# Altium project pca20037.PrjPCB
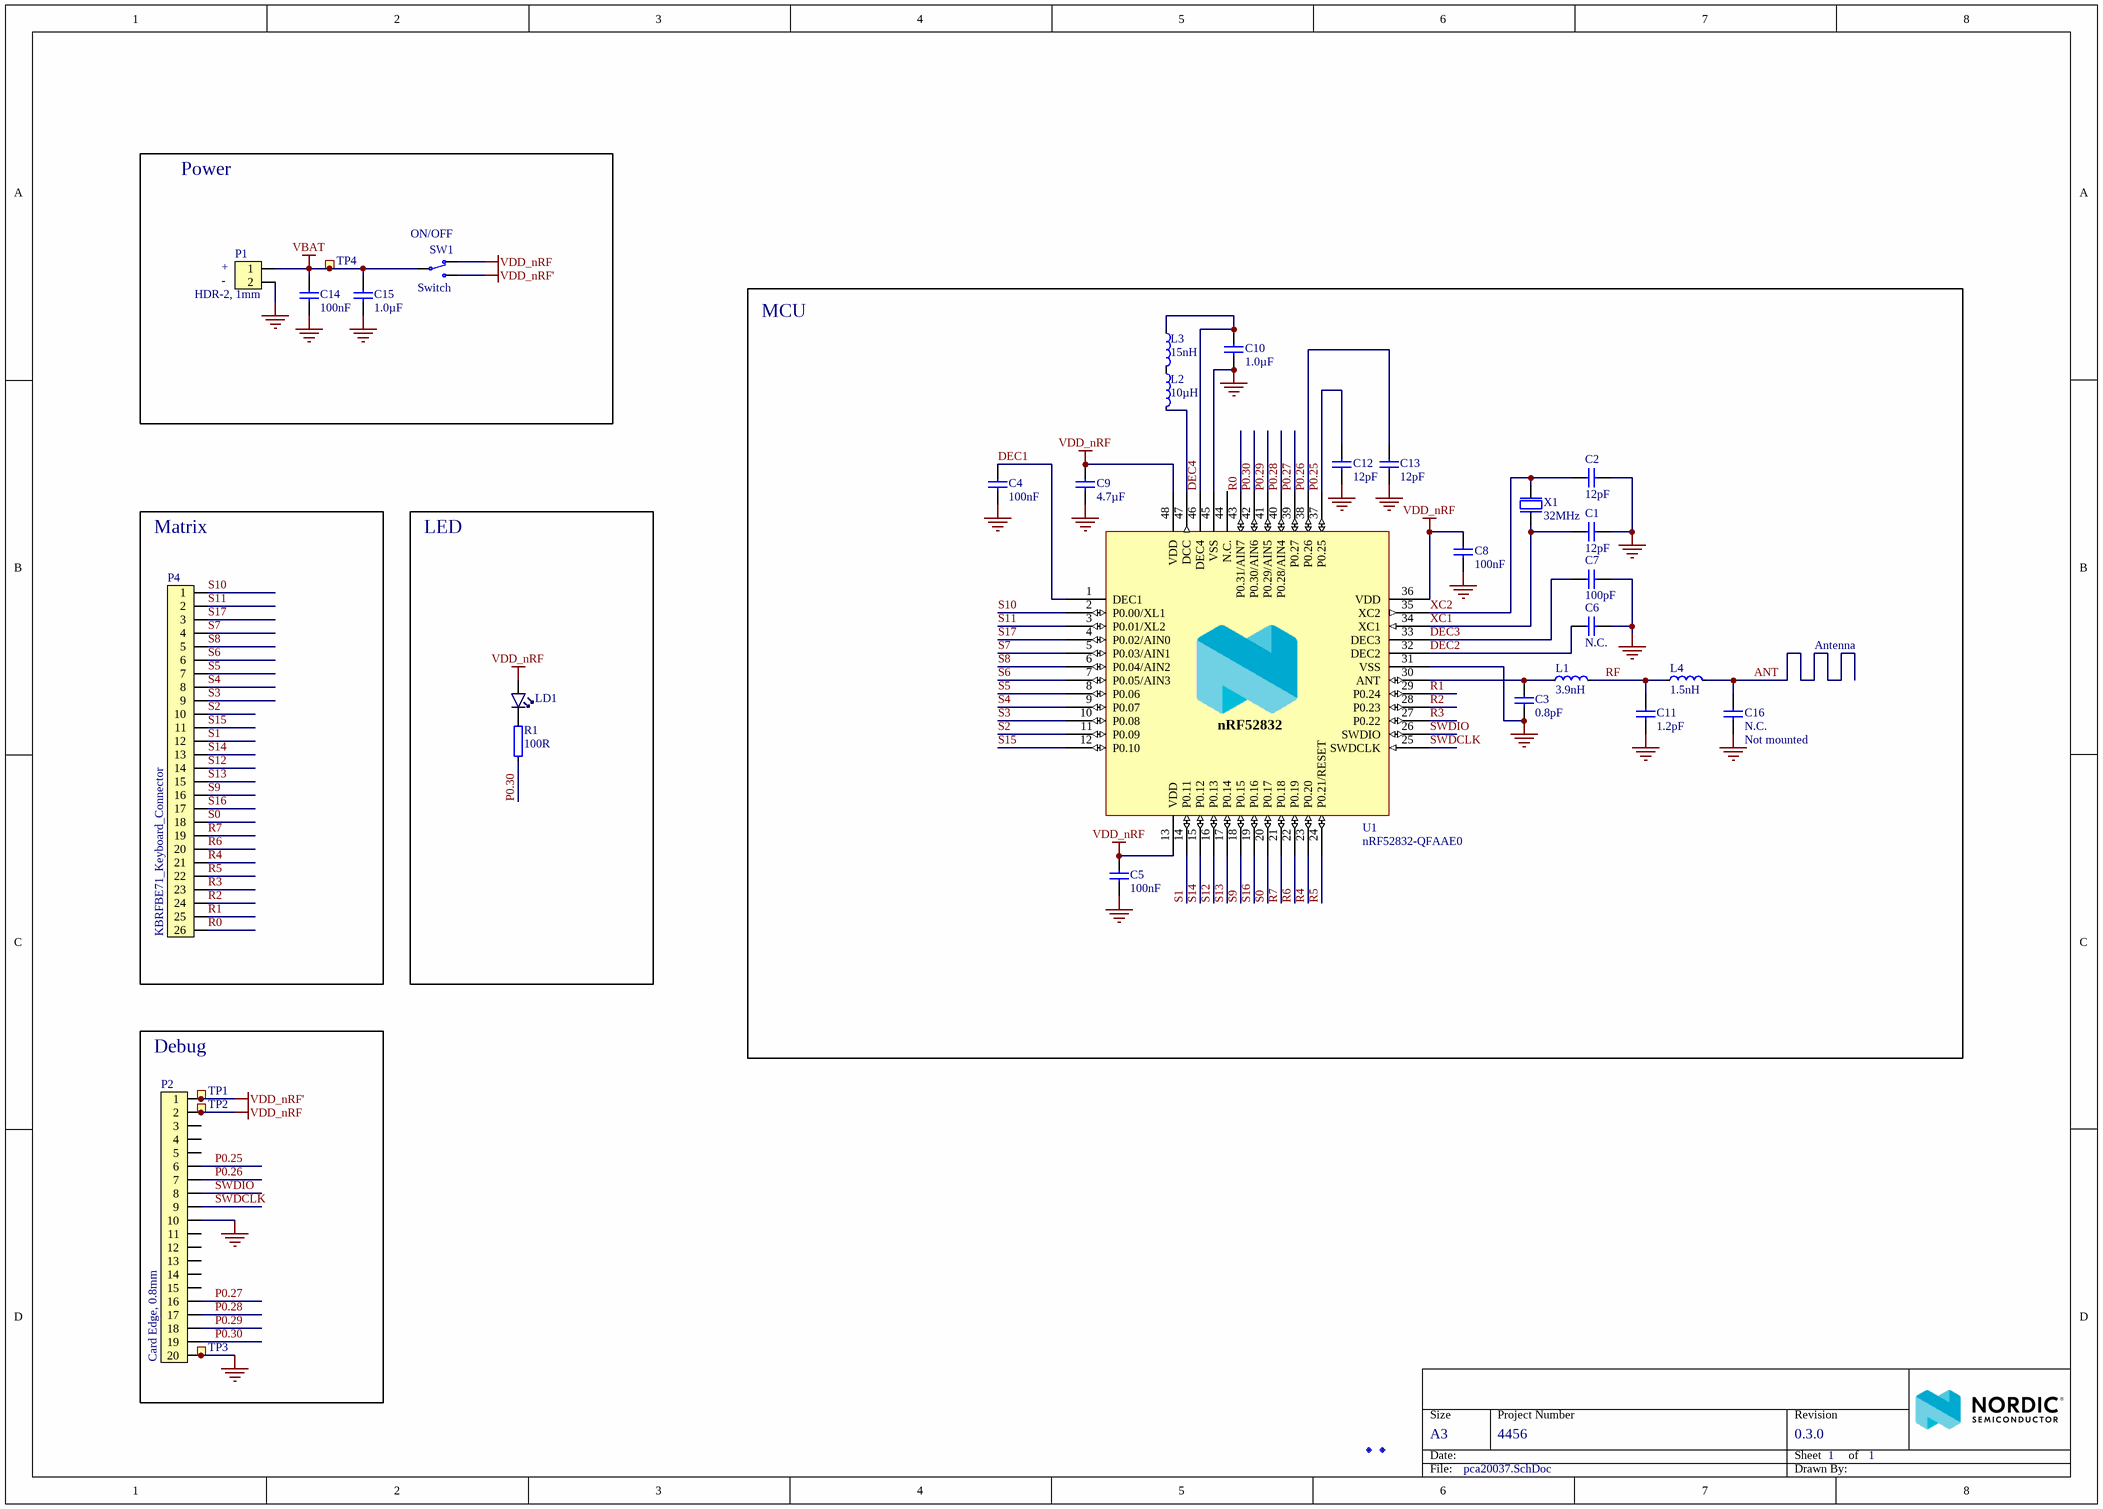
[diagram p0: pca20037.SchDoc]
Author: KJP/MASI; BoardThickness: 1.2mm; BoardTitle: nRF52832 Desktop Keyboard; NrOfLayers: 2; Organization: Nordic Semiconductor; PCAName: PCA20037; PCBNumber: 400342; PCBRevision: 0015MASI; PCBStackup: 2001; ProjectName: Demo Projects Applications Group; ProjectNumber: 4456; Revision: 0.3.0; SilkscreenColor: White; SoldermaskColor: Blue; SurfaceFinish: Lead-Free HASL
1 sheet, 34 parts. Net scope: global (net labels, ports and power ports of the same name join across sheets).
Board file: 400342.PcbDoc

## Sheet pca20037.SchDoc: =BoardTitle
size A3; Organization: Nordic Semiconductor; DocumentNumber: 1; Revision: 0.3.0; SheetNumber: 1; SheetTotal: 1; Author: KJP/MASI; CompanyName: Nordic Semiconductor; DrawnBy: KJP/MASI; ProjectNumber: 4456; ProjectName: Demo Projects Applications Group

### Parts
C1  12pF  [CAPC1005X04L]
C2  12pF  [CAPC1005X04L]
C3  0.8pF  [CAPC1005X04L]
C4  100nF  [CAPC1005X04L]
C5  100nF  [CAPC1005X04L]
C6  N.C.  [CAPC1005X04L]
C7  100pF  [CAPC1005X04L]
C8  100nF  [CAPC1005X04L]
C9  4.7µF  [CAPC1608X06L]
C10  1.0µF  [CAPC1608X06L]
C11  1.2pF  [CAPC1005X04L]
C12  12pF  [CAPC1005X04L]
C13  12pF  [CAPC1005X04L]
C14  100nF  [CAPC1005X04L]
C15  1.0µF  [CAPC1608X06L]
C16  N.C.  Assembly: Not mounted  [CAPC1005X04L]
Fiducual1  Fiducial mark  [Fiducial]  (value not drawn)
Fiducual2  Fiducial mark  [Fiducial]  (value not drawn)
L1  3.9nH  [INDC1005X04L]
L2  10µH  [INDC1608X06L]
L3  15nH  [INDC1005X04L]
L4  1.5nH  [INDC1005X04L]
LD1  L0603R  [LED_0603_R]  (value not drawn)
P1  HDR-2, 1mm  [SM02B-SRSS-TB]
P2  Card Edge, 0.8mm  [10056847-101LF]
P4  KBRFBE71_Keyboard_Connector  [KBRFBE71_Keyboard_Connector]
R1  100R  [RESC1005X04L]
SW1  Switch  [JS102011SAQN]
TP1  Ø0.7mm,SMD  [TP_SMD_Ø0.7mm]  (value not drawn)  (no BOM)
TP2  Ø0.7mm,SMD  [TP_SMD_Ø0.7mm]  (value not drawn)  (no BOM)
TP3  Ø0.7mm,SMD  [TP_SMD_Ø0.7mm]  (value not drawn)  (no BOM)
TP4  Ø0.7mm,SMD  [TP_SMD_Ø0.7mm]  (value not drawn)  (no BOM)
U1  nRF52832-QFAAE0  [QFN40P600X600X90-48N]
X1  32MHz  [BT-XTAL_2016]

### Blocks framed on the sheet
Power: C14 C15 P1 SW1 TP4
MCU: C1-C13 C16 L1-L4 U1 X1
Matrix: P4
LED: LD1 R1
Debug: P2 TP1-TP3

### Nets
GND: C1.2 C2.2 C3.1 C4.2 C5.2 C6.1 C7.2 C8.2 C9.2 C10.1 C11.2 C12.2 C13.2 C14.1 C15.1 C16.1 P1.2 P2.10 P2.20 TP3.1 U1.31(VSS) U1.45(VSS) U1.49(GND) X1.2(GND) X1.4(GND)
VBAT: C14.2 C15.2 P1.1 SW1.2(COM) TP4.1
VDD_nRF: C5.1 C8.1 C9.1 LD1.2(A) P2.2 SW1.1(N.C) TP2.1 U1.13(VDD) U1.36(VDD) U1.48(VDD)
VDD_nRF': P2.1 SW1.3(N.O) TP1.1
ANT: C16.2 L4.2
DEC1: C4.1 U1.1(DEC1)
DEC2: C6.2 U1.32(DEC2)
DEC3: C7.1 U1.33(DEC3)
DEC4: C10.2 L3.1 U1.46(DEC4)
P0.25: C12.1 P2.6 U1.37(P0.25)
P0.26: C13.1 P2.7 U1.38(P0.26)
P0.27: P2.16 U1.39(P0.27)
P0.28: P2.17 U1.40(P0.28/AIN4)
P0.29: P2.18 U1.41(P0.29/AIN5)
P0.30: P2.19 R1.1 U1.42(P0.30/AIN6)
R0: P4.26 U1.43(P0.31/AIN7)
R1: P4.25 U1.29(P0.24)
R2: P4.24 U1.28(P0.23)
R3: P4.23 U1.27(P0.22)
R4: P4.21 U1.23(P0.20)
R5: P4.22 U1.24(P0.21/RESET)
R6: P4.20 U1.22(P0.19)
R7: P4.19 U1.21(P0.18)
RF: C11.1 L1.2 L4.1
S0: P4.18 U1.20(P0.17)
S1: P4.12 U1.14(P0.11)
S2: P4.10 U1.11(P0.09)
S3: P4.9 U1.10(P0.08)
S4: P4.8 U1.9(P0.07)
S5: P4.7 U1.8(P0.06)
S6: P4.6 U1.7(P0.05/AIN3)
S7: P4.4 U1.5(P0.03/AIN1)
S8: P4.5 U1.6(P0.04/AIN2)
S9: P4.16 U1.18(P0.15)
S10: P4.1 U1.2(P0.00/XL1)
S11: P4.2 U1.3(P0.01/XL2)
S12: P4.14 U1.16(P0.13)
S13: P4.15 U1.17(P0.14)
S14: P4.13 U1.15(P0.12)
S15: P4.11 U1.12(P0.10)
S16: P4.17 U1.19(P0.16)
S17: P4.3 U1.4(P0.02/AIN0)
SWDCLK: P2.9 U1.25(SWDCLK)
SWDIO: P2.8 U1.26(SWDIO)
XC1: C1.1 U1.34(XC1) X1.1(inp)
XC2: C2.1 U1.35(XC2) X1.3(out)
NetC3_2: C3.2 L1.1 U1.30(ANT)
NetL2_1: L2.1 L3.2
NetL2_2: L2.2 U1.47(DCC)
NetLD1_1: LD1.1(C) R1.2

Not connected (* = marked no-connect by the designer): P2 3 4 5 11 12 13 14 15; U1 44(N.C.)

### Notes on the sheet
- (near SW1) ON/OFF
- (near P1) +
- (near P1) -
- Antenna
- Size
- Date:
- A3
- Project Number
- Sheet         of
- Revision
- File:
- Drawn By:
- (in symbol nRF52832-QFAAE0) nRF52832

### Library data of the parts
C1 C2 C12 C13 = C0402-12p: Capacitor, NP0, ±2%; Part number IPS: 00000002398; Note: 50V; Artikkelnr Noca: 20029159; Part Number: C0402-12p; Manufacturer: *; Manufacturer Part Number: *; LatestRevisionDate: 2011-05-11; Pin Count: 2; Publisher: Nordic Semiconductor; Published: 2009-05-08; Value: 12pF; Footprint Doc: 0402; ComponentLink1URL: *; ComponentLink1Description: Datasheet; ComponentLink2URL: *; ComponentLink2Description: Supplier link; HelpURL: *; Supplier 1: *; Supplier Part Number 1: *; Supplier 2: *; Supplier Part Number 2: *
C3 = C0402-0.8p: Capacitor, NP0, ±5%; Part number IPS: 00000007782; Note: 50V; Artikkelnr Noca: 20029147; Part Number: C0402-0.8p; Manufacturer: *; Manufacturer Part Number: *; LatestRevisionDate: 2012-11-21; Pin Count: 2; Publisher: Nordic Semiconductor; Published: 2009-05-08; Value: 0.8pF; Footprint Doc: 0402; ComponentLink1URL: *; ComponentLink1Description: Datasheet; ComponentLink2URL: *; ComponentLink2Description: Supplier link; HelpURL: *; Supplier 1: *; Supplier Part Number 1: *; Supplier 2: *; Supplier Part Number 2: *
C4 C5 C8 C14 = C0402-100n: Capacitor, X7R, ±10%; Part number IPS: 00000005296; Note: 16V; Artikkelnr Noca: 20039200; Part Number: C0402-100n; Manufacturer: *; Manufacturer Part Number: *; LatestRevisionDate: 2009-11-23; Pin Count: 2; Publisher: Nordic Semiconductor; Published: 2009-05-08; Value: 100nF; Footprint Doc: 0402; ComponentLink1URL: *; ComponentLink1Description: Datasheet; ComponentLink2URL: *; ComponentLink2Description: Supplier link; HelpURL: *; Supplier 1: *; Supplier Part Number 1: *; Supplier 2: *; Supplier Part Number 2: *
C6 = C0402-N.C.: Not mounted; Note: Chip Cap; Artikkelnr Noca: N.A.; Assembly: Not mounted; Part Number: C0402-N.C.; Manufacturer: *; Manufacturer Part Number: *; LatestRevisionDate: 2009-05-08; Pin Count: 2; Publisher: Nordic Semiconductor; Published: 2009-05-08; Value: N.C.; Footprint Doc: 0402; Part number IPS: N.A.; ComponentLink1URL: *; ComponentLink1Description: Datasheet; ComponentLink2URL: *; ComponentLink2Description: Supplier link; HelpURL: *; Supplier 1: *; Supplier Part Number 1: *; Supplier 2: *; Supplier Part Number 2: *
C7 = C0402-100p: Capacitor, NP0, ±5%; Part number IPS: 00000002361; Note: 50V; Artikkelnr Noca: 20029135; Part Number: C0402-100p; Manufacturer: *; Manufacturer Part Number: *; LatestRevisionDate: 2009-05-08; Pin Count: 2; Publisher: Nordic Semiconductor; Published: 2009-05-08; Value: 100pF; Footprint Doc: 0402; ComponentLink1URL: *; ComponentLink1Description: Datasheet; ComponentLink2URL: *; ComponentLink2Description: Supplier link; HelpURL: *; Supplier 1: *; Supplier Part Number 1: *; Supplier 2: *; Supplier Part Number 2: *
C9 = C0603-4µ7: Capacitor, X5R, ±10%; Part number IPS: 00000007783; Note: 6.3V; Artikkelnr Noca: 20069060; Part Number: C0603-4µ7; Manufacturer: *; Manufacturer Part Number: *; LatestRevisionDate: 2009-11-23; Pin Count: 2; Publisher: Nordic Semiconductor; Published: 2009-05-08; Value: 4.7µF; Footprint Doc: 0603; ComponentLink1URL: *; ComponentLink1Description: Datasheet; ComponentLink2URL: *; ComponentLink2Description: Supplier link; HelpURL: *; Supplier 1: *; Supplier Part Number 1: *; Supplier 2: *; Supplier Part Number 2: *
C10 C15 = C0603-1µ0: Capacitor, X7R, ±10%; Part number IPS: 00000000616; Note: 16V; Artikkelnr Noca: 20039282; Part Number: C0603-1µ0; Manufacturer: *; Manufacturer Part Number: *; LatestRevisionDate: 2013-06-05; Pin Count: 2; Publisher: Nordic Semiconductor; Published: 2009-05-08; Value: 1.0µF; Footprint Doc: 0603; ComponentLink1URL: *; ComponentLink1Description: Datasheet; ComponentLink2URL: *; ComponentLink2Description: Supplier link; HelpURL: *; Supplier 1: *; Supplier Part Number 1: *; Supplier 2: *; Supplier Part Number 2: *
C11 = C0402-1.2p: Capacitor, NP0, ±0.1pF; Part number IPS: 00000005410; Note: 50V; Artikkelnr Noca: 20029157; Part Number: C0402-1.2p; Manufacturer: *; Manufacturer Part Number: *; LatestRevisionDate: 2011-05-11; Pin Count: 2; Publisher: Nordic Semiconductor; Published: 2009-05-08; Value: 1.2pF; Footprint Doc: 0402; ComponentLink1URL: *; ComponentLink1Description: Datasheet; ComponentLink2URL: *; ComponentLink2Description: Supplier link; HelpURL: *; Supplier 1: *; Supplier Part Number 1: *; Supplier 2: *; Supplier Part Number 2: *
C16 = C0402-N.C.: Not mounted; Note: Chip Cap; Artikkelnr Noca: N.A.; Part Number: C0402-N.C.; Manufacturer: *; Manufacturer Part Number: *; LatestRevisionDate: 2009-05-08; Pin Count: 2; Publisher: Nordic Semiconductor; Published: 2009-05-08; Value: N.C.; Footprint Doc: 0402; Part number IPS: N.A.; ComponentLink1Description: Datasheet; ComponentLink2Description: Supplier link; ComponentLink1URL: *; ComponentLink2URL: *; HelpURL: *; Supplier 1: *; Supplier Part Number 1: *; Supplier 2: *; Supplier Part Number 2: *
Fiducual1 Fiducual2 = Fid-Mark: Artikkelnr Noca: N.A.; Part Number: Fid-Mark; Manufacturer: *; Manufacturer Part Number: *; LatestRevisionDate: 2009-12-12; Pin Count: 1; Publisher: Nordic Semiconductor; Published: 2009-12-12; Value: *; Note: *; Footprint Doc: Fiducial; Part number IPS: N.A.; ComponentLink1URL: *; ComponentLink1Description: Datasheet; ComponentLink2URL: *; ComponentLink2Description: Supplier link; HelpURL: *; Supplier 1: *; Supplier Part Number 1: *; Supplier 2: *; Supplier Part Number 2: *
L1 = L0402-3n9: Inductor, 170mA, ±0.1nH; Manufacturer: Murata; Manufacturer Part Number: LQP15MN3N9B02D; Part number IPS: 00000007793; Note: High frequency chip inductor ±5%; Artikkelnr Noca: 33029151; Part Number: L0402-3n9; LatestRevisionDate: 2012-09-19; Pin Count: 2; Publisher: Nordic Semiconductor; Published: 2009-05-08; Value: 3.9nH; Footprint Doc: 0402; ComponentLink1Description: Datasheet; ComponentLink2Description: Supplier link; ComponentLink1URL: *; ComponentLink2URL: *; HelpURL: http://search.murata.co.jp/Ceramy/image/img/PDF/ENG/L0075S0084LQP15M.pdf; Supplier 1: Digi-Key; Supplier Part Number 1: 490-1131-1-ND; Supplier 2: *; Supplier Part Number 2: *
L2 = L0603-10µ: Inductor, 80mA, ±10%; Manufacturer: Taiyo Yuden; Manufacturer Part Number: LBMF1608T100K; Part number IPS: 00000007794; Note: LBMF1608T100K 10µH 80mA 0603; Artikkelnr Noca: 33029314; Part Number: L0603-10µ; LatestRevisionDate: 2012-09-19; Pin Count: 2; Publisher: Nordic Semiconductor; Published: 2010-02-24; Value: 10µH; Footprint Doc: 0603; ComponentLink1Description: Datasheet; ComponentLink2Description: Supplier link; ComponentLink1URL: *; ComponentLink2URL: *; HelpURL: http://www.yuden.co.jp/ut/product/pdf/elb2_e.pdf; Supplier 1: Digi-Key; Supplier Part Number 1: 587-1714-1-ND; Supplier 2: Farnell; Supplier Part Number 2: 178-6105
L3 = L0402-15n: Inductor, 320mA, ±5%; Manufacturer: Taiyo Yuden; Manufacturer Part Number: HK100515NJ-T; Part number IPS: 00000001262; Note: High frequency chip inductor ±10%; Artikkelnr Noca: 33029323; Part Number: L0402-15n; LatestRevisionDate: 2012-09-19; Pin Count: 2; Publisher: Nordic Semiconductor; Published: 2010-07-12; Value: 15nH; Footprint Doc: 0402; ComponentLink1Description: Datasheet; ComponentLink2Description: Supplier link; ComponentLink1URL: *; ComponentLink2URL: *; HelpURL: http://www.yuden.co.jp/productdata/catalog/en/mlci04_e.pdf; Supplier 1: Digi-Key; Supplier Part Number 1: 587-1521-1-ND; Supplier 2: Farnell; Supplier Part Number 2: 658-1328
L4 = L0402-1n5: Inductor, 280mA, ±0.1nH; Manufacturer: Murata; Manufacturer Part Number: LQP15MN1N5B02D; Note: High frequency chip inductor ±5%; Artikkelnr Noca: N.A.; Part Number: L0402-1n5; LatestRevisionDate: 2012-09-19; Pin Count: 2; Publisher: Nordic Semiconductor; Published: 2009-05-08; Value: 1.5nH; Footprint Doc: 0402; Part number IPS: N.A.; ComponentLink1URL: *; ComponentLink1Description: Datasheet; ComponentLink2URL: *; ComponentLink2Description: Supplier link; HelpURL: http://search.murata.co.jp/Ceramy/image/img/PDF/ENG/L0075S0084LQP15M.pdf; Supplier 1: Digi-Key; Supplier Part Number 1: 490-1126-1-ND; Supplier 2: *; Supplier Part Number 2: *
LD1 = EL19-21SURC: LED 0603, EL19-21SURC; Manufacturer: Everlight; Manufacturer Part Number: EL-19-21SURC/S530-A2/TR8; Part number IPS: N.A.; Note: 39 mcd @ 20 mA; Artikkelnr Noca: 13019043; Part Number: EL19-21SURC; ComponentLink1URL: *; ComponentLink1Description: Datasheet; ComponentLink2URL: *; ComponentLink2Description: Supplier link; HelpURL: http://media.digikey.com/pdf/Data%20Sheets/Everlight%20PDFs/19-21SURC,S530-A3,TR8.pdf; Footprint Doc: 0603; LatestRevisionDate: 2013-06-04; Pin Count: 2; Publisher: Nordic Semiconductor; Published: 2009-05-18; Value: L0603R; Supplier 1: Mouser; Supplier Part Number 1: 638-192SURCS530-A2; Supplier 2: *; Supplier Part Number 2: *
P1 = SM02B-SRSS-TB: 1.0mm pitch connector side entry SMD; Manufacturer: JST; Manufacturer Part Number: SM02B-SRSS-TB(LF)(SN); Part number IPS: 00000007791; Note: JST, Header; Artikkelnr Noca: 55010030; Part Number: SM02B-SRSS-TB; ComponentLink1URL: *; ComponentLink1Description: Datasheet; ComponentLink2URL: *; ComponentLink2Description: Supplier link; HelpURL: http://www.jst-mfg.com/product/pdf/eng/eSH.pdf; Footprint Doc: SM02B-SRSS-TB; LatestRevisionDate: 2016-06-20; Pin Count: 2; Publisher: Nordic Semiconductor; Published: 2016-06-20; Value: HDR-2, 1mm; Supplier 1: Digi-Key; Supplier Part Number 1: 455-1802-1-ND; Supplier 2: *; Supplier Part Number 2: *
P2 = 10056847-101LF: 0.8mm pitch, dual edge, right angle, SMD, card edge connector; Manufacturer: FCI; Artikkelnr Noca: N.A.; Part Number: 10056847-101LF; Manufacturer Part Number: 10056847-101LF; Footprint Doc: 10056847-101LF; LatestRevisionDate: 2018-05-07; Pin Count: 20; Publisher: Nordic Semiconductor; Published: 2018-05-07; Value: Card Edge, 0.8mm; Note: *; Part number IPS: N.A.; ComponentLink1URL: https://www.amphenol-icc.com/media/wysiwyg/files/drawing/10056847.pdf; ComponentLink1Description: Datasheet; ComponentLink2URL: *; ComponentLink2Description: Supplier link; HelpURL: *; Supplier 1: Digi-Key; Supplier Part Number 1: 609-4943-1-ND; Supplier 2: *; Supplier Part Number 2: *
P4 = KBRFBE71_Keyboard_Connector: KBRFBE71 Keyboard Connector; Artikkelnr Noca: N.A.; Part Number: KBRFBE71_Keyboard_Connector; Manufacturer: *; Manufacturer Part Number: *; ComponentLink1URL: *; ComponentLink1Description: Datasheet; ComponentLink2URL: *; ComponentLink2Description: *; HelpURL: *; Footprint Doc: KBRFBE71_Keyboard_Connector; LatestRevisionDate: 2018-12-12; Pin Count: 26; Publisher: Nordic Semiconductor; Published: 2018-12-12; Value: KBRFBE71_Keyboard_Connector; Note: KBRFBE71 Keyboard Connector; Supplier 1: *; Supplier Part Number 1: *; Supplier 2: *; Supplier Part Number 2: *; Part number IPS: N.A.
R1 = R0402-100: Resistor, ±1%, 0.063W; Part number IPS: 00000002811; Note: Chip Res 1%; Artikkelnr Noca: 27049049; Part Number: R0402-100; Manufacturer: *; Manufacturer Part Number: *; LatestRevisionDate: 2009-11-23; Pin Count: 2; Publisher: Nordic Semiconductor; Published: 2009-05-08; Value: 100R; Footprint Doc: 0402; ComponentLink1URL: *; ComponentLink1Description: Datasheet; ComponentLink2URL: *; ComponentLink2Description: Supplier link; HelpURL: *; Supplier 1: Farnell; Supplier Part Number 1: 173-8837; Supplier 2: *; Supplier Part Number 2: *
SW1 = JS102011SAQN: SMD slide Switch (ON-ON); Manufacturer: C&K Components; Part number IPS: N.A.; Artikkelnr Noca: 50019064; Part Number: JS102011SAQN; Manufacturer Part Number: JS102011SAQN; ComponentLink1URL: *; ComponentLink1Description: Datasheet; ComponentLink2URL: *; ComponentLink2Description: Supplier link; HelpURL: http://www.ck-components.com/14398/js_14july11.pdf/; Footprint Doc: JS102011SAQN; LatestRevisionDate: 2011-08-15; Pin Count: 3; Publisher: Nordic Semiconductor; Published: 2011-08-15; Value: Switch; Note: *; Supplier 1: Digi-Key; Supplier Part Number 1: 401-1999-1-ND; Supplier 2: Mouser; Supplier Part Number 2: 611-JS102011SAQN
TP1-TP4 = TP_SMD_Ø0.7MM: 0.7mm circular SMD testpad; Manufacturer: Nordic Semiconductor; Artikkelnr Noca: N.A.; Part Number: TP_SMD_Ø0.7MM; Manufacturer Part Number: *; ComponentLink1URL: *; ComponentLink1Description: Datasheet; ComponentLink2URL: *; ComponentLink2Description: Supplier link; HelpURL: *; Footprint Doc: TP_SMD_Ø0.7mm; LatestRevisionDate: 2017-12-14; Pin Count: 1; Publisher: Nordic Semiconductor; Published: 2017-12-14; Value: Ø0.7mm,SMD; Note: *; Supplier 1: *; Supplier Part Number 1: *; Supplier 2: *; Supplier Part Number 2: *; Part number IPS: N.A.
U1 = nRF52832-QFAAE0: Multi-protocol Bluetooth Low Energy, ANT and 2.4GHz proprietary system-on-chip; Manufacturer: Nordic Semiconductor; Artikkelnr Noca: N.A.; Part Number: nRF52832-QFAAE0; Manufacturer Part Number: nRF52832-QFAAE0; ComponentLink1URL: *; ComponentLink1Description: Datasheet; ComponentLink2URL: *; ComponentLink2Description: Supplier link; HelpURL: *; Footprint Doc: QFN-48; LatestRevisionDate: 2017-10-18; Pin Count: 48; Publisher: Nordic Semiconductor; Published: 2017-10-18; Value: nRF52832-QFAAE0; Note: *; Supplier 1: Nordic Semiconductor; Supplier Part Number 1: nRF52832-QFAAE0; Supplier 2: *; Supplier Part Number 2: *; Part number IPS: N.A.
X1 = XTAL_SMD2016_32MHz_8pF_KDS: XTAL SMD 2016, 32MHz, Cl=8pF, Tol: ±10ppm, Stab: ±20ppm; Manufacturer: KDS; Manufacturer Part Number: DSX211G; Note: XTAL SMD 32.000MHz; Artikkelnr Noca: N.A.; Part Number: XTAL_SMD2016_32MHz_8pF_KDS; LatestRevisionDate: 2017-06-09; Pin Count: 4; Publisher: Nordic Semiconductor; Published: 2017-06-09; Value: 32MHz; Footprint Doc: XTAL_2016; Part number IPS: N.A.; ComponentLink1URL: *; ComponentLink1Description: Datasheet; ComponentLink2URL: *; ComponentLink2Description: Supplier link; HelpURL: http://ftp.kds.info/products/DSX210GE_211G_car_en.pdf; Supplier 1: *; Supplier Part Number 1: *; Supplier 2: *; Supplier Part Number 2: *